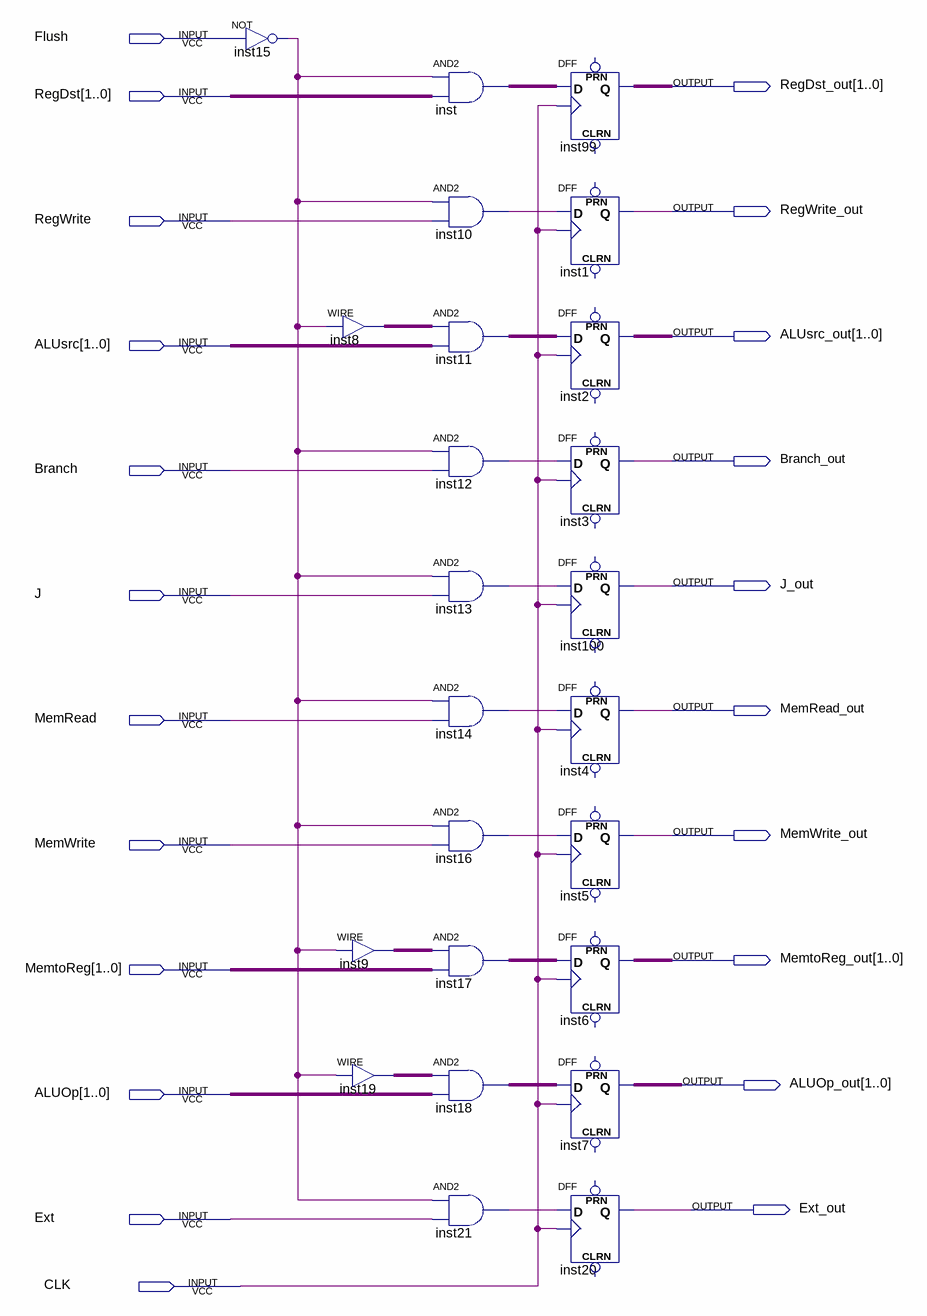
[diagram p0: schematic sheet]
// Quartus schematic ID_EX_control.bdf as structural Verilog: 24 symbols, 22 pins
module ID_EX_control (
  input  Flush,
  input  [1:0] RegDst,
  input  RegWrite,
  input  [1:0] ALUsrc,
  input  Branch,
  input  J,
  input  MemRead,
  input  MemWrite,
  input  [1:0] MemtoReg,
  input  [1:0] ALUOp,
  input  Ext,
  input  CLK,
  output [1:0] RegDst_out,
  output RegWrite_out,
  output [1:0] ALUsrc_out,
  output Branch_out,
  output J_out,
  output MemRead_out,
  output MemWrite_out,
  output [1:0] MemtoReg_out,
  output [1:0] ALUOp_out,
  output Ext_out
);

  wire inst10_out, inst12_out, inst13_out, inst14_out, inst15_out, inst16_out, inst21_out;
  wire [1:0] inst8_out, inst9_out, inst11_out, inst17_out, inst18_out, inst19_out, inst_out;

  not inst15 (inst15_out, Flush);
  assign inst8_out = {2{inst15_out}};  // WIRE inst8
  assign inst9_out = {2{inst15_out}};  // WIRE inst9
  assign inst19_out = {2{inst15_out}};  // WIRE inst19
  assign inst_out = {2{inst15_out}} & RegDst;  // AND2 inst, 2 bits wide
  and inst10 (inst10_out, inst15_out, RegWrite);
  assign inst11_out = inst8_out & ALUsrc;  // AND2 inst11, 2 bits wide
  and inst12 (inst12_out, inst15_out, Branch);
  and inst13 (inst13_out, inst15_out, J);
  and inst14 (inst14_out, inst15_out, MemRead);
  and inst16 (inst16_out, inst15_out, MemWrite);
  assign inst17_out = inst9_out & MemtoReg;  // AND2 inst17, 2 bits wide
  assign inst18_out = inst19_out & ALUOp;  // AND2 inst18, 2 bits wide
  and inst21 (inst21_out, inst15_out, Ext);
  DFF inst99[1:0] (.CLK(CLK), .D(inst_out), .Q(RegDst_out));  // open: CLRN, PRN
  DFF inst1 (.CLK(CLK), .D(inst10_out), .Q(RegWrite_out));  // open: CLRN, PRN
  DFF inst2[1:0] (.CLK(CLK), .D(inst11_out), .Q(ALUsrc_out));  // open: CLRN, PRN
  DFF inst3 (.CLK(CLK), .D(inst12_out), .Q(Branch_out));  // open: CLRN, PRN
  DFF inst100 (.CLK(CLK), .D(inst13_out), .Q(J_out));  // open: CLRN, PRN
  DFF inst4 (.CLK(CLK), .D(inst14_out), .Q(MemRead_out));  // open: CLRN, PRN
  DFF inst5 (.CLK(CLK), .D(inst16_out), .Q(MemWrite_out));  // open: CLRN, PRN
  DFF inst6[1:0] (.CLK(CLK), .D(inst17_out), .Q(MemtoReg_out));  // open: CLRN, PRN
  DFF inst7[1:0] (.CLK(CLK), .D(inst18_out), .Q(ALUOp_out));  // open: CLRN, PRN
  DFF inst20 (.CLK(CLK), .D(inst21_out), .Q(Ext_out));  // open: CLRN, PRN
endmodule
